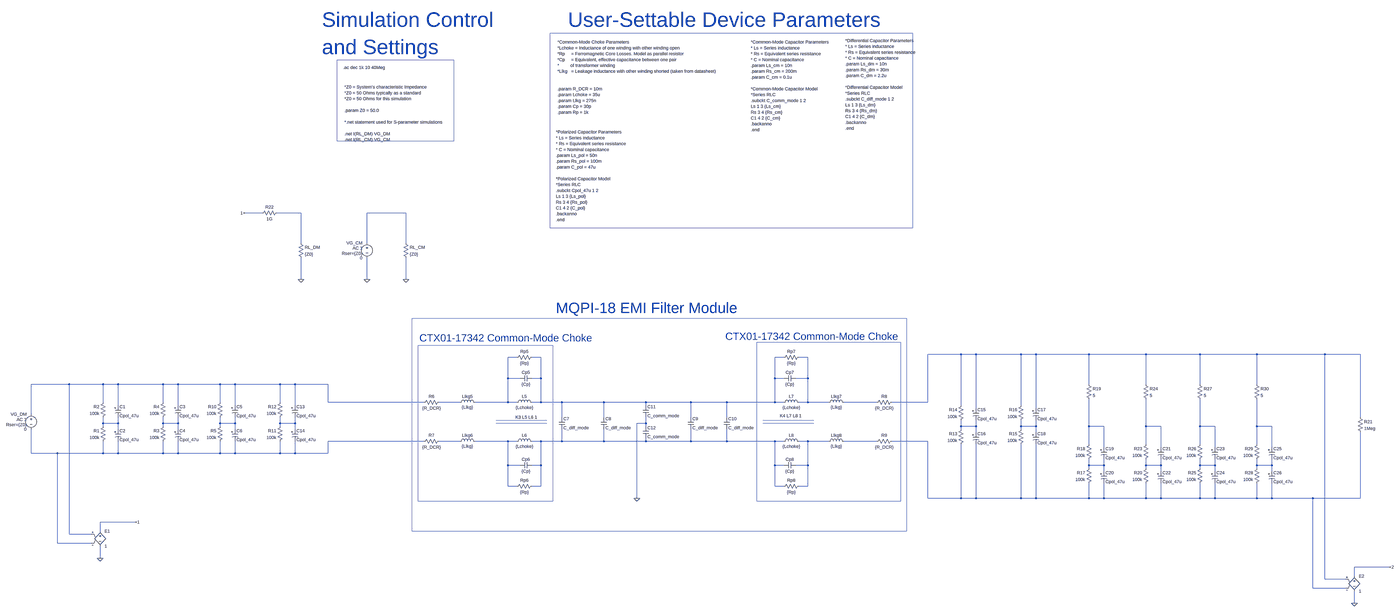
[diagram p0: schematic Example_EMI_Filter.asc, whole sheet]
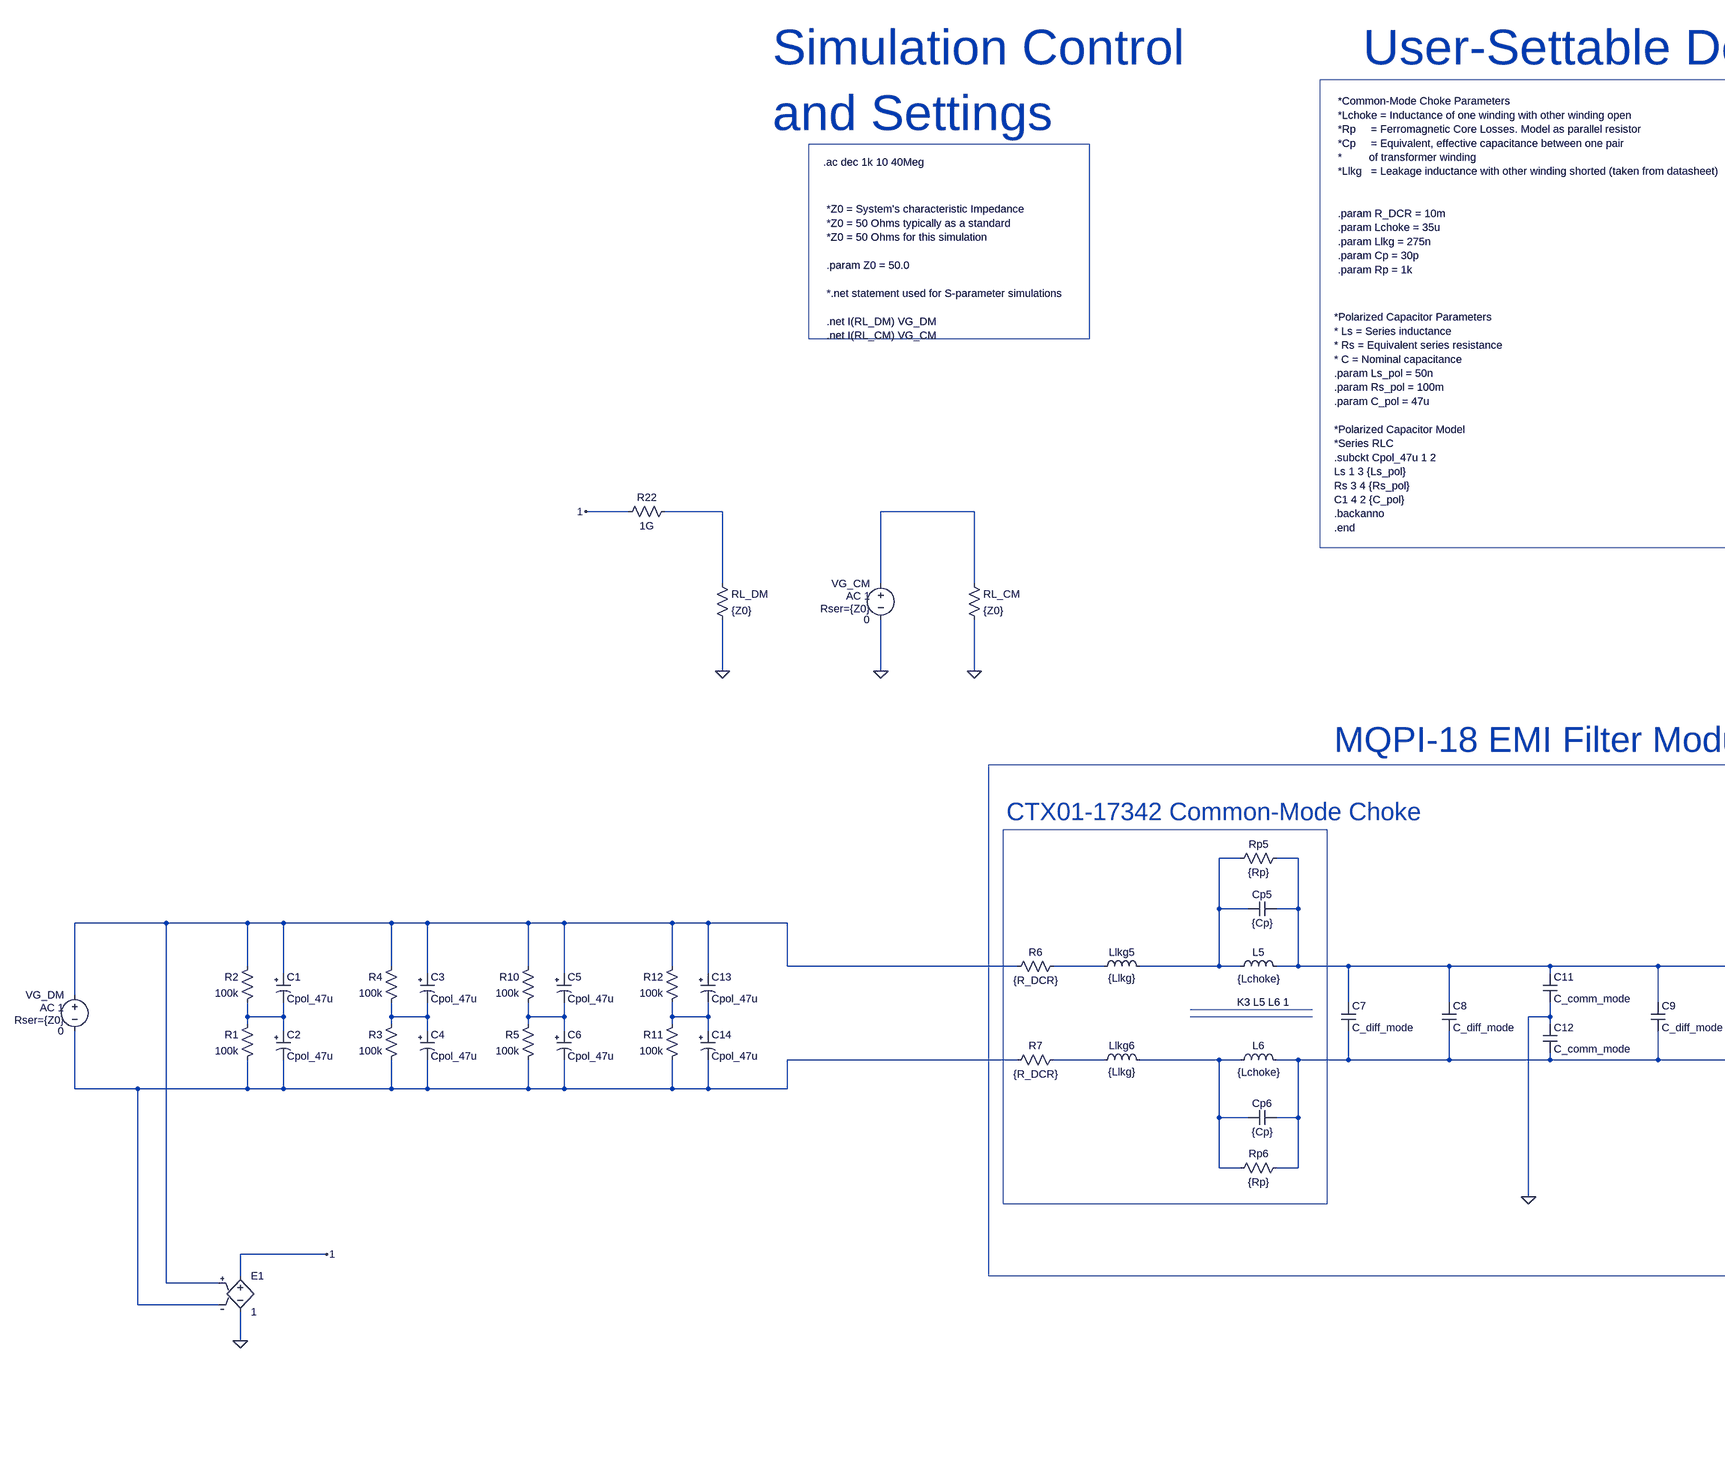
[diagram p1: schematic Example_EMI_Filter.asc, part, row 1 of 1, column 1 of 2]
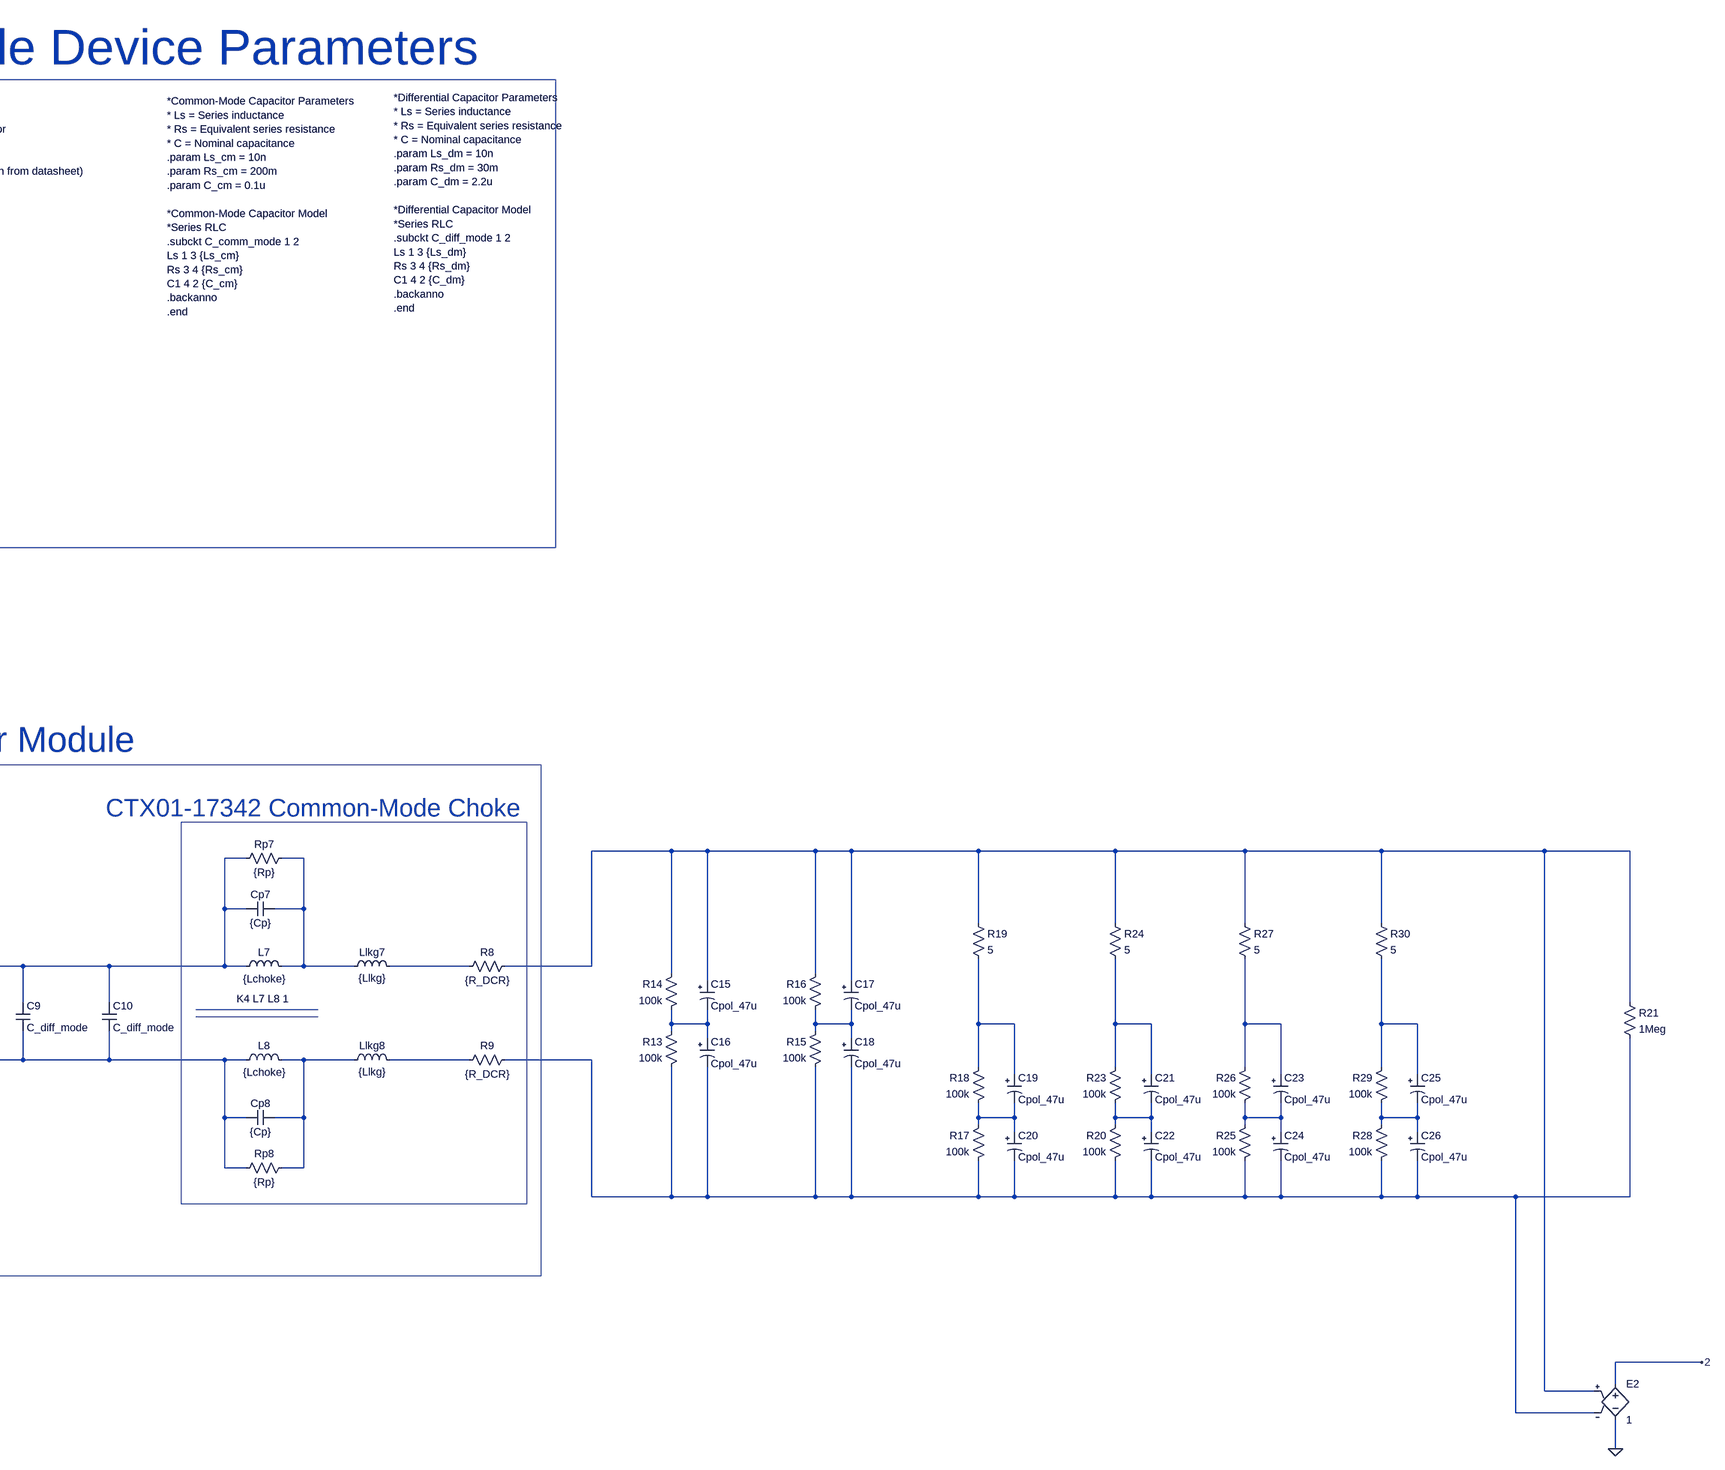
[diagram p2: schematic Example_EMI_Filter.asc, part, row 1 of 1, column 2 of 2]
Example_EMI_Filter.asc, the LTspice schematic file:
Version 4.1
SHEET 1 6096 2036
WIRE -48 -1056 -144 -1056
WIRE 160 -1056 32 -1056
WIRE 720 -1056 512 -1056
WIRE 160 -896 160 -1056
WIRE 512 -896 512 -1056
WIRE 720 -896 720 -1056
WIRE 160 -688 160 -816
WIRE 512 -688 512 -816
WIRE 720 -688 720 -816
WIRE 3728 -48 3504 -48
WIRE 3808 -48 3728 -48
WIRE 4048 -48 3808 -48
WIRE 4128 -48 4048 -48
WIRE 4416 -48 4128 -48
WIRE 4720 -48 4416 -48
WIRE 5008 -48 4720 -48
WIRE 5312 -48 5008 -48
WIRE 5696 -48 5312 -48
WIRE 5904 -48 5696 -48
WIRE 1312 -32 1264 -32
WIRE 1440 -32 1392 -32
WIRE 2736 -32 2688 -32
WIRE 2864 -32 2816 -32
WIRE 1264 80 1264 -32
WIRE 1328 80 1264 80
WIRE 1440 80 1440 -32
WIRE 1440 80 1392 80
WIRE 2688 80 2688 -32
WIRE 2736 80 2688 80
WIRE 2864 80 2864 -32
WIRE 2864 80 2800 80
WIRE -1088 112 -1440 112
WIRE -896 112 -1088 112
WIRE -816 112 -896 112
WIRE -576 112 -816 112
WIRE -496 112 -576 112
WIRE -272 112 -496 112
WIRE -192 112 -272 112
WIRE 48 112 -192 112
WIRE 128 112 48 112
WIRE 304 112 128 112
WIRE 4416 112 4416 -48
WIRE 4720 112 4720 -48
WIRE 5008 112 5008 -48
WIRE 5312 112 5312 -48
WIRE -896 208 -896 112
WIRE -576 208 -576 112
WIRE -272 208 -272 112
WIRE 48 208 48 112
WIRE 304 208 304 112
WIRE 816 208 304 208
WIRE 1008 208 896 208
WIRE 1264 208 1264 80
WIRE 1264 208 1088 208
WIRE 1312 208 1264 208
WIRE 1440 208 1440 80
WIRE 1440 208 1392 208
WIRE 1552 208 1440 208
WIRE 1776 208 1552 208
WIRE 2000 208 1776 208
WIRE 2240 208 2000 208
WIRE 2432 208 2240 208
WIRE 2688 208 2688 80
WIRE 2688 208 2432 208
WIRE 2736 208 2688 208
WIRE 2864 208 2864 80
WIRE 2864 208 2816 208
WIRE 2976 208 2864 208
WIRE 3232 208 3056 208
WIRE 3504 208 3504 -48
WIRE 3504 208 3312 208
WIRE -816 224 -816 112
WIRE -496 224 -496 112
WIRE -192 224 -192 112
WIRE 128 224 128 112
WIRE 2000 224 2000 208
WIRE 3728 224 3728 -48
WIRE 4048 224 4048 -48
WIRE 3808 240 3808 -48
WIRE 4128 240 4128 -48
WIRE -1440 272 -1440 112
WIRE 1552 288 1552 208
WIRE 1776 288 1776 208
WIRE 2240 288 2240 208
WIRE 2432 288 2432 208
WIRE 5904 288 5904 -48
WIRE -896 320 -896 288
WIRE -816 320 -816 288
WIRE -816 320 -896 320
WIRE -576 320 -576 288
WIRE -496 320 -496 288
WIRE -496 320 -576 320
WIRE -272 320 -272 288
WIRE -192 320 -192 288
WIRE -192 320 -272 320
WIRE 48 320 48 288
WIRE 128 320 128 288
WIRE 128 320 48 320
WIRE 2000 320 2000 288
WIRE 2000 320 1952 320
WIRE -896 336 -896 320
WIRE -576 336 -576 320
WIRE -272 336 -272 320
WIRE 48 336 48 320
WIRE 2000 336 2000 320
WIRE 3728 336 3728 304
WIRE 3808 336 3808 304
WIRE 3808 336 3728 336
WIRE 4048 336 4048 304
WIRE 4128 336 4128 304
WIRE 4128 336 4048 336
WIRE 4416 336 4416 192
WIRE 4496 336 4416 336
WIRE 4720 336 4720 192
WIRE 4800 336 4720 336
WIRE 5008 336 5008 192
WIRE 5088 336 5008 336
WIRE 5312 336 5312 192
WIRE 5392 336 5312 336
WIRE -816 352 -816 320
WIRE -496 352 -496 320
WIRE -192 352 -192 320
WIRE 128 352 128 320
WIRE 3728 352 3728 336
WIRE 4048 352 4048 336
WIRE 3808 368 3808 336
WIRE 4128 368 4128 336
WIRE 816 416 304 416
WIRE 1008 416 896 416
WIRE 1264 416 1088 416
WIRE 1312 416 1264 416
WIRE 1440 416 1392 416
WIRE 1552 416 1552 352
WIRE 1552 416 1440 416
WIRE 1776 416 1776 352
WIRE 1776 416 1552 416
WIRE 2000 416 2000 400
WIRE 2000 416 1776 416
WIRE 2240 416 2240 352
WIRE 2240 416 2000 416
WIRE 2432 416 2432 352
WIRE 2432 416 2240 416
WIRE 2688 416 2432 416
WIRE 2736 416 2688 416
WIRE 2864 416 2816 416
WIRE 2976 416 2864 416
WIRE 3232 416 3056 416
WIRE 3504 416 3312 416
WIRE 4416 432 4416 336
WIRE 4720 432 4720 336
WIRE 5008 432 5008 336
WIRE 5312 432 5312 336
WIRE 4496 448 4496 336
WIRE 4800 448 4800 336
WIRE 5088 448 5088 336
WIRE 5392 448 5392 336
WIRE -1440 480 -1440 352
WIRE -1152 480 -1440 480
WIRE -896 480 -896 416
WIRE -896 480 -1152 480
WIRE -816 480 -816 416
WIRE -816 480 -896 480
WIRE -576 480 -576 416
WIRE -576 480 -816 480
WIRE -496 480 -496 416
WIRE -496 480 -576 480
WIRE -272 480 -272 416
WIRE -272 480 -496 480
WIRE -192 480 -192 416
WIRE -192 480 -272 480
WIRE 48 480 48 416
WIRE 48 480 -192 480
WIRE 128 480 128 416
WIRE 128 480 48 480
WIRE 304 480 304 416
WIRE 304 480 128 480
WIRE 1264 544 1264 416
WIRE 1328 544 1264 544
WIRE 1440 544 1440 416
WIRE 1440 544 1392 544
WIRE 2688 544 2688 416
WIRE 2736 544 2688 544
WIRE 2864 544 2864 416
WIRE 2864 544 2800 544
WIRE 4416 544 4416 512
WIRE 4496 544 4496 512
WIRE 4496 544 4416 544
WIRE 4720 544 4720 512
WIRE 4800 544 4800 512
WIRE 4800 544 4720 544
WIRE 5008 544 5008 512
WIRE 5088 544 5088 512
WIRE 5088 544 5008 544
WIRE 5312 544 5312 512
WIRE 5392 544 5392 512
WIRE 5392 544 5312 544
WIRE 4416 560 4416 544
WIRE 4720 560 4720 544
WIRE 5008 560 5008 544
WIRE 5312 560 5312 544
WIRE 4496 576 4496 544
WIRE 4800 576 4800 544
WIRE 5088 576 5088 544
WIRE 5392 576 5392 544
WIRE 1264 656 1264 544
WIRE 1312 656 1264 656
WIRE 1440 656 1440 544
WIRE 1440 656 1392 656
WIRE 2688 656 2688 544
WIRE 2736 656 2688 656
WIRE 2864 656 2864 544
WIRE 2864 656 2816 656
WIRE 1952 720 1952 320
WIRE 3504 720 3504 416
WIRE 3728 720 3728 432
WIRE 3728 720 3504 720
WIRE 3808 720 3808 432
WIRE 3808 720 3728 720
WIRE 4048 720 4048 432
WIRE 4048 720 3808 720
WIRE 4128 720 4128 432
WIRE 4128 720 4048 720
WIRE 4416 720 4416 640
WIRE 4416 720 4128 720
WIRE 4496 720 4496 640
WIRE 4496 720 4416 720
WIRE 4720 720 4720 640
WIRE 4720 720 4496 720
WIRE 4800 720 4800 640
WIRE 4800 720 4720 720
WIRE 5008 720 5008 640
WIRE 5008 720 4800 720
WIRE 5088 720 5088 640
WIRE 5088 720 5008 720
WIRE 5312 720 5312 640
WIRE 5312 720 5088 720
WIRE 5392 720 5392 640
WIRE 5392 720 5312 720
WIRE 5632 720 5392 720
WIRE 5904 720 5904 368
WIRE 5904 720 5632 720
WIRE -720 848 -912 848
WIRE -912 896 -912 848
WIRE -1088 912 -1088 112
WIRE -960 912 -1088 912
WIRE -1152 960 -1152 480
WIRE -960 960 -1152 960
WIRE -912 1040 -912 976
WIRE 6064 1088 5872 1088
WIRE 5872 1136 5872 1088
WIRE 5696 1152 5696 -48
WIRE 5824 1152 5696 1152
WIRE 5632 1200 5632 720
WIRE 5824 1200 5632 1200
WIRE 5872 1280 5872 1216
FLAG 1952 720 0
FLAG -720 848 1
FLAG 720 -688 0
FLAG 160 -688 0
FLAG 512 -688 0
FLAG -144 -1056 1
FLAG -912 1040 0
FLAG 6064 1088 2
FLAG 5872 1280 0
SYMBOL ind 1408 224 M270
WINDOW 0 32 56 VTop 2
WINDOW 3 4 56 VBottom 2
SYMATTR InstName L5
SYMATTR Value {Lchoke}
SYMATTR Type ind
SYMBOL ind 1408 432 M270
WINDOW 0 32 56 VTop 2
WINDOW 3 4 56 VBottom 2
SYMATTR InstName L6
SYMATTR Value {Lchoke}
SYMATTR Type ind
SYMBOL ind 2720 224 R270
WINDOW 0 32 56 VTop 2
WINDOW 3 4 56 VBottom 2
SYMATTR InstName L7
SYMATTR Value {Lchoke}
SYMATTR Type ind
SYMBOL ind 2720 432 R270
WINDOW 0 32 56 VTop 2
WINDOW 3 4 56 VBottom 2
SYMATTR InstName L8
SYMATTR Value {Lchoke}
SYMATTR Type ind
SYMBOL cap 1536 288 R0
SYMATTR InstName C7
SYMATTR Value C_diff_mode
SYMATTR Prefix X
SYMBOL cap 1760 288 R0
SYMATTR InstName C8
SYMATTR Value C_diff_mode
SYMATTR Prefix X
SYMBOL cap 2224 288 R0
SYMATTR InstName C9
SYMATTR Value C_diff_mode
SYMATTR Prefix X
SYMBOL cap 2416 288 R0
SYMATTR InstName C10
SYMATTR Value C_diff_mode
SYMATTR Prefix X
SYMBOL cap 1984 224 R0
SYMATTR InstName C11
SYMATTR Value C_comm_mode
SYMATTR Prefix X
SYMBOL cap 1984 336 R0
SYMATTR InstName C12
SYMATTR Value C_comm_mode
SYMATTR Prefix X
SYMBOL res 800 224 R270
WINDOW 0 32 56 VTop 2
WINDOW 3 0 56 VBottom 2
SYMATTR InstName R6
SYMATTR Value {R_DCR}
SYMBOL res 800 432 R270
WINDOW 0 32 56 VTop 2
WINDOW 3 0 56 VBottom 2
SYMATTR InstName R7
SYMATTR Value {R_DCR}
SYMBOL res 3216 224 R270
WINDOW 0 32 56 VTop 2
WINDOW 3 0 56 VBottom 2
SYMATTR InstName R8
SYMATTR Value {R_DCR}
SYMBOL res 3216 432 R270
WINDOW 0 32 56 VTop 2
WINDOW 3 0 56 VBottom 2
SYMATTR InstName R9
SYMATTR Value {R_DCR}
SYMBOL ind 1104 224 M270
WINDOW 0 32 56 VTop 2
WINDOW 3 5 56 VBottom 2
SYMATTR InstName Llkg5
SYMATTR Value {Llkg}
SYMBOL ind 1104 432 M270
WINDOW 0 32 56 VTop 2
WINDOW 3 5 56 VBottom 2
SYMATTR InstName Llkg6
SYMATTR Value {Llkg}
SYMBOL ind 2960 224 R270
WINDOW 0 32 56 VTop 2
WINDOW 3 5 56 VBottom 2
SYMATTR InstName Llkg7
SYMATTR Value {Llkg}
SYMBOL ind 2960 432 R270
WINDOW 0 32 56 VTop 2
WINDOW 3 5 56 VBottom 2
SYMATTR InstName Llkg8
SYMATTR Value {Llkg}
SYMBOL cap 1328 64 M90
WINDOW 0 0 32 VBottom 2
WINDOW 3 32 32 VTop 2
SYMATTR InstName Cp5
SYMATTR Value {Cp}
SYMBOL cap 1328 528 M90
WINDOW 0 0 32 VBottom 2
WINDOW 3 32 32 VTop 2
SYMATTR InstName Cp6
SYMATTR Value {Cp}
SYMBOL cap 2800 64 R90
WINDOW 0 0 32 VBottom 2
WINDOW 3 32 32 VTop 2
SYMATTR InstName Cp7
SYMATTR Value {Cp}
SYMBOL cap 2800 528 R90
WINDOW 0 0 32 VBottom 2
WINDOW 3 32 32 VTop 2
SYMATTR InstName Cp8
SYMATTR Value {Cp}
SYMBOL res 1296 -16 R270
WINDOW 0 32 56 VTop 2
WINDOW 3 0 56 VBottom 2
SYMATTR InstName Rp5
SYMATTR Value {Rp}
SYMBOL res 1296 672 R270
WINDOW 0 32 56 VTop 2
WINDOW 3 0 56 VBottom 2
SYMATTR InstName Rp6
SYMATTR Value {Rp}
SYMBOL res 2720 -16 R270
WINDOW 0 32 56 VTop 2
WINDOW 3 0 56 VBottom 2
SYMATTR InstName Rp7
SYMATTR Value {Rp}
SYMBOL res 2720 672 R270
WINDOW 0 32 56 VTop 2
WINDOW 3 0 56 VBottom 2
SYMATTR InstName Rp8
SYMATTR Value {Rp}
SYMBOL polcap -832 224 R0
SYMATTR InstName C1
SYMATTR Value Cpol_47u
SYMATTR Prefix X
SYMBOL polcap -832 352 R0
SYMATTR InstName C2
SYMATTR Value Cpol_47u
SYMATTR Prefix X
SYMBOL res -880 320 M0
SYMATTR InstName R1
SYMATTR Value 100k
SYMBOL res -880 192 M0
SYMATTR InstName R2
SYMATTR Value 100k
SYMBOL polcap -512 224 R0
SYMATTR InstName C3
SYMATTR Value Cpol_47u
SYMATTR Prefix X
SYMBOL polcap -512 352 R0
SYMATTR InstName C4
SYMATTR Value Cpol_47u
SYMATTR Prefix X
SYMBOL res -560 320 M0
SYMATTR InstName R3
SYMATTR Value 100k
SYMBOL res -560 192 M0
SYMATTR InstName R4
SYMATTR Value 100k
SYMBOL polcap 3792 240 R0
SYMATTR InstName C15
SYMATTR Value Cpol_47u
SYMATTR Prefix X
SYMBOL polcap 3792 368 R0
SYMATTR InstName C16
SYMATTR Value Cpol_47u
SYMATTR Prefix X
SYMBOL res 3744 336 M0
SYMATTR InstName R13
SYMATTR Value 100k
SYMBOL res 3744 208 M0
SYMATTR InstName R14
SYMATTR Value 100k
SYMBOL polcap 4112 240 R0
SYMATTR InstName C17
SYMATTR Value Cpol_47u
SYMATTR Prefix X
SYMBOL polcap 4112 368 R0
SYMATTR InstName C18
SYMATTR Value Cpol_47u
SYMATTR Prefix X
SYMBOL res 4064 336 M0
SYMATTR InstName R15
SYMATTR Value 100k
SYMBOL res 4064 208 M0
SYMATTR InstName R16
SYMATTR Value 100k
SYMBOL voltage -1440 256 M0
WINDOW 123 24 44 Left 2
WINDOW 39 24 72 Left 2
SYMATTR Value2 AC 1
SYMATTR SpiceLine Rser={Z0}
SYMATTR InstName VG_DM
SYMATTR Value 0
SYMBOL res 5888 272 R0
SYMATTR InstName R21
SYMATTR Value 1Meg
SYMBOL res 144 -912 R0
SYMATTR InstName RL_DM
SYMATTR Value {Z0}
SYMBOL res 704 -912 R0
SYMATTR InstName RL_CM
SYMATTR Value {Z0}
SYMBOL voltage 512 -912 M0
WINDOW 123 24 44 Left 2
WINDOW 39 24 72 Left 2
SYMATTR Value2 AC 1
SYMATTR SpiceLine Rser={Z0}
SYMATTR InstName VG_CM
SYMATTR Value 0
SYMBOL res -64 -1040 R270
WINDOW 0 32 56 VTop 2
WINDOW 3 0 56 VBottom 2
SYMATTR InstName R22
SYMATTR Value 1G
SYMBOL polcap 4480 448 R0
SYMATTR InstName C19
SYMATTR Value Cpol_47u
SYMATTR Prefix X
SYMBOL polcap 4480 576 R0
SYMATTR InstName C20
SYMATTR Value Cpol_47u
SYMATTR Prefix X
SYMBOL res 4432 544 M0
SYMATTR InstName R17
SYMATTR Value 100k
SYMBOL res 4432 416 M0
SYMATTR InstName R18
SYMATTR Value 100k
SYMBOL res 4400 96 R0
SYMATTR InstName R19
SYMATTR Value 5
SYMBOL polcap 4784 448 R0
SYMATTR InstName C21
SYMATTR Value Cpol_47u
SYMATTR Prefix X
SYMBOL polcap 4784 576 R0
SYMATTR InstName C22
SYMATTR Value Cpol_47u
SYMATTR Prefix X
SYMBOL res 4736 544 M0
SYMATTR InstName R20
SYMATTR Value 100k
SYMBOL res 4736 416 M0
SYMATTR InstName R23
SYMATTR Value 100k
SYMBOL res 4704 96 R0
SYMATTR InstName R24
SYMATTR Value 5
SYMBOL polcap 5072 448 R0
SYMATTR InstName C23
SYMATTR Value Cpol_47u
SYMATTR Prefix X
SYMBOL polcap 5072 576 R0
SYMATTR InstName C24
SYMATTR Value Cpol_47u
SYMATTR Prefix X
SYMBOL res 5024 544 M0
SYMATTR InstName R25
SYMATTR Value 100k
SYMBOL res 5024 416 M0
SYMATTR InstName R26
SYMATTR Value 100k
SYMBOL res 4992 96 R0
SYMATTR InstName R27
SYMATTR Value 5
SYMBOL polcap 5376 448 R0
SYMATTR InstName C25
SYMATTR Value Cpol_47u
SYMATTR Prefix X
SYMBOL polcap 5376 576 R0
SYMATTR InstName C26
SYMATTR Value Cpol_47u
SYMATTR Prefix X
SYMBOL res 5328 544 M0
SYMATTR InstName R28
SYMATTR Value 100k
SYMBOL res 5328 416 M0
SYMATTR InstName R29
SYMATTR Value 100k
SYMBOL res 5296 96 R0
SYMATTR InstName R30
SYMATTR Value 5
SYMBOL e -912 880 R0
SYMATTR InstName E1
SYMATTR Value 1
SYMBOL e 5872 1120 R0
SYMATTR InstName E2
SYMATTR Value 1
SYMBOL polcap -208 224 R0
SYMATTR InstName C5
SYMATTR Value Cpol_47u
SYMATTR Prefix X
SYMBOL polcap -208 352 R0
SYMATTR InstName C6
SYMATTR Value Cpol_47u
SYMATTR Prefix X
SYMBOL res -256 320 M0
SYMATTR InstName R5
SYMATTR Value 100k
SYMBOL res -256 192 M0
SYMATTR InstName R10
SYMATTR Value 100k
SYMBOL polcap 112 224 R0
SYMATTR InstName C13
SYMATTR Value Cpol_47u
SYMATTR Prefix X
SYMBOL polcap 112 352 R0
SYMATTR InstName C14
SYMATTR Value Cpol_47u
SYMATTR Prefix X
SYMBOL res 64 320 M0
SYMATTR InstName R11
SYMATTR Value 100k
SYMBOL res 64 192 M0
SYMATTR InstName R12
SYMATTR Value 100k
TEXT 1528 -1968 Left 2 !*Common-Mode Choke Parameters\n*Lchoke = Inductance of one winding with other winding open\n*Rp     = Ferromagnetic Core Losses. Model as parallel resistor\n*Cp     = Equivalent, effective capacitance between one pair\n*         of transformer winding\n*Llkg   = Leakage inductance with other winding shorted (taken from datasheet)\n \n \n.param R_DCR = 10m\n.param Lchoke = 35u\n.param Llkg = 275n\n.param Cp = 30p\n.param Rp = 1k
TEXT 384 -1832 Left 2 !.ac dec 1k 10 40Meg
TEXT 392 -1728 Left 2 !*Z0 = System's characteristic Impedance\n*Z0 = 50 Ohms typically as a standard\n*Z0 = 50 Ohms for this simulation\n \n.param Z0 = 50.0\n \n*.net statement used for S-parameter simulations\n \n.net I(RL_DM) VG_DM\n.net I(RL_CM) VG_CM
TEXT 3064 -1976 Left 2 !*Differential Capacitor Parameters\n* Ls = Series inductance\n* Rs = Equivalent series resistance \n* C = Nominal capacitance\n.param Ls_dm = 10n\n.param Rs_dm = 30m\n.param C_dm = 2.2u\n \n*Differential Capacitor Model\n*Series RLC\n.subckt C_diff_mode 1 2\nLs 1 3 {Ls_dm}\nRs 3 4 {Rs_dm}\nC1 4 2 {C_dm}\n.backanno\n.end
TEXT 2560 -1968 Left 2 !*Common-Mode Capacitor Parameters\n* Ls = Series inductance\n* Rs = Equivalent series resistance \n* C = Nominal capacitance\n.param Ls_cm = 10n\n.param Rs_cm = 200m\n.param C_cm = 0.1u\n \n*Common-Mode Capacitor Model\n*Series RLC\n.subckt C_comm_mode 1 2\nLs 1 3 {Ls_cm}\nRs 3 4 {Rs_cm}\nC1 4 2 {C_cm}\n.backanno\n.end
TEXT 1304 288 Left 2 !K3 L5 L6 1
TEXT 2832 280 Right 2 !K4 L7 L8 1
TEXT 1584 -2088 Left 7 ;User-Settable Device Parameters
TEXT 272 -2088 Left 7 ;Simulation Control\nand Settings
TEXT 792 -136 Left 5 ;CTX01-17342 Common-Mode Choke
TEXT 2424 -144 Left 5 ;CTX01-17342 Common-Mode Choke
TEXT 1520 -296 Left 6 ;MQPI-18 EMI Filter Module
TEXT 1520 -1488 Left 2 !*Polarized Capacitor Parameters\n* Ls = Series inductance\n* Rs = Equivalent series resistance \n* C = Nominal capacitance\n.param Ls_pol = 50n\n.param Rs_pol = 100m\n.param C_pol = 47u\n \n*Polarized Capacitor Model\n*Series RLC\n.subckt Cpol_47u 1 2\nLs 1 3 {Ls_pol}\nRs 3 4 {Rs_pol}\nC1 4 2 {C_pol}\n.backanno\n.end
LINE Normal 1472 304 1200 304
LINE Normal 1472 320 1200 320
LINE Normal 2896 304 2624 304
LINE Normal 2896 320 2624 320
RECTANGLE Normal 3392 896 752 -240
RECTANGLE Normal 3424 -976 1488 -2016
RECTANGLE Normal 976 -1440 352 -1872
RECTANGLE Normal 3360 736 2592 -112
RECTANGLE Normal 1504 736 784 -96

The netlist it stands for:
* Example_EMI_Filter.asc
L5 N005 N004 {Lchoke}
L6 N023 N022 {Lchoke}
L7 N005 N006 {Lchoke}
L8 N023 N024 {Lchoke}
X§C7 N005 N023 C_diff_mode  ; pins A B
X§C8 N005 N023 C_diff_mode  ; pins A B
X§C9 N005 N023 C_diff_mode  ; pins A B
X§C10 N005 N023 C_diff_mode  ; pins A B
X§C11 N005 0 C_comm_mode  ; pins A B
X§C12 0 N023 C_comm_mode  ; pins A B
R6 N007 N008 {R_DCR}
R7 N020 N021 {R_DCR}
R8 N009 N003 {R_DCR}
R9 N025 N026 {R_DCR}
Llkg5 N004 N008 {Llkg}
Llkg6 N022 N021 {Llkg}
Llkg7 N006 N009 {Llkg}
Llkg8 N024 N025 {Llkg}
Cp5 N004 N005 {Cp}
Cp6 N022 N023 {Cp}
Cp7 N006 N005 {Cp}
Cp8 N024 N023 {Cp}
Rp5 N004 N005 {Rp}
Rp6 N022 N023 {Rp}
Rp7 N005 N006 {Rp}
Rp8 N023 N024 {Rp}
X§C1 N007 N010 Cpol_47u  ; pins A B
X§C2 N010 N020 Cpol_47u  ; pins A B
R1 N010 N020 100k
R2 N007 N010 100k
X§C3 N007 N011 Cpol_47u  ; pins A B
X§C4 N011 N020 Cpol_47u  ; pins A B
R3 N011 N020 100k
R4 N007 N011 100k
X§C15 N003 N014 Cpol_47u  ; pins A B
X§C16 N014 N026 Cpol_47u  ; pins A B
R13 N014 N026 100k
R14 N003 N014 100k
X§C17 N003 N015 Cpol_47u  ; pins A B
X§C18 N015 N026 Cpol_47u  ; pins A B
R15 N015 N026 100k
R16 N003 N015 100k
VG_DM N007 N020 0 AC 1 Rser={Z0}
R21 N003 N026 1Meg
RL_DM N001 0 {Z0}
RL_CM N002 0 {Z0}
VG_CM N002 0 0 AC 1 Rser={Z0}
R22 1 N001 1G
X§C19 N016 N027 Cpol_47u  ; pins A B
X§C20 N027 N026 Cpol_47u  ; pins A B
R17 N027 N026 100k
R18 N016 N027 100k
R19 N003 N016 5
X§C21 N017 N028 Cpol_47u  ; pins A B
X§C22 N028 N026 Cpol_47u  ; pins A B
R20 N028 N026 100k
R23 N017 N028 100k
R24 N003 N017 5
X§C23 N018 N029 Cpol_47u  ; pins A B
X§C24 N029 N026 Cpol_47u  ; pins A B
R25 N029 N026 100k
R26 N018 N029 100k
R27 N003 N018 5
X§C25 N019 N030 Cpol_47u  ; pins A B
X§C26 N030 N026 Cpol_47u  ; pins A B
R28 N030 N026 100k
R29 N019 N030 100k
R30 N003 N019 5
E1 1 0 N007 N020 1
E2 2 0 N003 N026 1
X§C5 N007 N012 Cpol_47u  ; pins A B
X§C6 N012 N020 Cpol_47u  ; pins A B
R5 N012 N020 100k
R10 N007 N012 100k
X§C13 N007 N013 Cpol_47u  ; pins A B
X§C14 N013 N020 Cpol_47u  ; pins A B
R11 N013 N020 100k
R12 N007 N013 100k
*Common-Mode Choke Parameters
*Lchoke = Inductance of one winding with other winding open
*Rp     = Ferromagnetic Core Losses. Model as parallel resistor
*Cp     = Equivalent, effective capacitance between one pair
*         of transformer winding
*Llkg   = Leakage inductance with other winding shorted (taken from datasheet)
.param R_DCR = 10m
.param Lchoke = 35u
.param Llkg = 275n
.param Cp = 30p
.param Rp = 1k
.ac dec 1k 10 40Meg
*Z0 = System's characteristic Impedance
*Z0 = 50 Ohms typically as a standard
*Z0 = 50 Ohms for this simulation
.param Z0 = 50.0
*.net statement used for S-parameter simulations
.net I(RL_DM) VG_DM
.net I(RL_CM) VG_CM
*Differential Capacitor Parameters
* Ls = Series inductance
* Rs = Equivalent series resistance
* C = Nominal capacitance
.param Ls_dm = 10n
.param Rs_dm = 30m
.param C_dm = 2.2u
*Differential Capacitor Model
*Series RLC
.subckt C_diff_mode 1 2
Ls 1 3 {Ls_dm}
Rs 3 4 {Rs_dm}
C1 4 2 {C_dm}
.backanno
.end
*Common-Mode Capacitor Parameters
* Ls = Series inductance
* Rs = Equivalent series resistance
* C = Nominal capacitance
.param Ls_cm = 10n
.param Rs_cm = 200m
.param C_cm = 0.1u
*Common-Mode Capacitor Model
*Series RLC
.subckt C_comm_mode 1 2
Ls 1 3 {Ls_cm}
Rs 3 4 {Rs_cm}
C1 4 2 {C_cm}
.backanno
.end
K3 L5 L6 1
K4 L7 L8 1
* User-Settable Device Parameters
* Simulation Control
* and Settings
* CTX01-17342 Common-Mode Choke
* CTX01-17342 Common-Mode Choke
* MQPI-18 EMI Filter Module
*Polarized Capacitor Parameters
* Ls = Series inductance
* Rs = Equivalent series resistance
* C = Nominal capacitance
.param Ls_pol = 50n
.param Rs_pol = 100m
.param C_pol = 47u
*Polarized Capacitor Model
*Series RLC
.subckt Cpol_47u 1 2
Ls 1 3 {Ls_pol}
Rs 3 4 {Rs_pol}
C1 4 2 {C_pol}
.backanno
.end
.backanno
.end